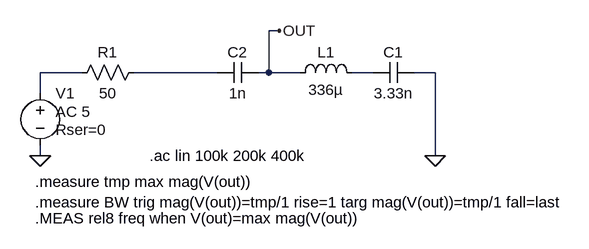
[diagram p0: schematic Draft7.asc]
Draft7.asc, the LTspice schematic file:
Version 4
SHEET 1 880 680
WIRE -2000 -384 -2016 -384
WIRE -2304 -320 -2368 -320
WIRE -2096 -320 -2224 -320
WIRE -2016 -320 -2016 -384
WIRE -2016 -320 -2032 -320
WIRE -1968 -320 -2016 -320
WIRE -1856 -320 -1888 -320
WIRE -1760 -320 -1792 -320
WIRE -2368 -288 -2368 -320
WIRE -2368 -192 -2368 -208
WIRE -1760 -192 -1760 -320
FLAG -2368 -192 0
FLAG -1760 -192 0
FLAG -2000 -384 OUT
SYMBOL ind -1984 -304 R270
WINDOW 0 32 56 VTop 2
WINDOW 3 5 56 VBottom 2
SYMATTR InstName L1
SYMATTR Value 336µ
SYMATTR SpiceLine Rser=1
SYMBOL voltage -2368 -304 R0
WINDOW 3 24 44 Left 2
WINDOW 123 24 44 Left 2
WINDOW 39 24 72 Left 2
SYMATTR Value ""
SYMATTR Value2 AC 5
SYMATTR SpiceLine Rser=0
SYMATTR InstName V1
SYMBOL res -2320 -304 R270
WINDOW 0 32 56 VTop 2
WINDOW 3 0 56 VBottom 2
SYMATTR InstName R1
SYMATTR Value 50
SYMBOL cap -1792 -336 R90
WINDOW 0 0 32 VBottom 2
WINDOW 3 32 32 VTop 2
SYMATTR InstName C1
SYMATTR Value 3.33n
SYMBOL cap -2032 -336 R90
WINDOW 0 0 32 VBottom 2
WINDOW 3 32 32 VTop 2
SYMATTR InstName C2
SYMATTR Value 1n
TEXT -2200 -192 Left 2 !.ac lin 100k 200k 400k 
TEXT -2376 -152 Left 2 !.measure tmp max mag(V(out))\n.measure BW trig mag(V(out))=tmp/1 rise=1 targ mag(V(out))=tmp/1 fall=last
TEXT -2376 -96 Left 2 !.MEAS rel8 freq when V(out)=max mag(V(out))

The netlist it stands for:
* Draft7.asc
L1 OUT N003 336µ Rser=1
V1 N001 0 AC 5 Rser=0
R1 N001 N002 50
C1 0 N003 3.33n
C2 OUT N002 1n
.ac lin 100k 200k 400k
.measure tmp max mag(V(out))
.measure BW trig mag(V(out))=tmp/1 rise=1 targ mag(V(out))=tmp/1 fall=last
.MEAS rel8 freq when V(out)=max mag(V(out))
.backanno
.end